# Altium schematic sheet DRAM_LPDDR4X_200P_2X32bit.SchDoc (part 1 of 2)
size 594 x 420 mm; SheetNumber: 16; SheetTotal: 23
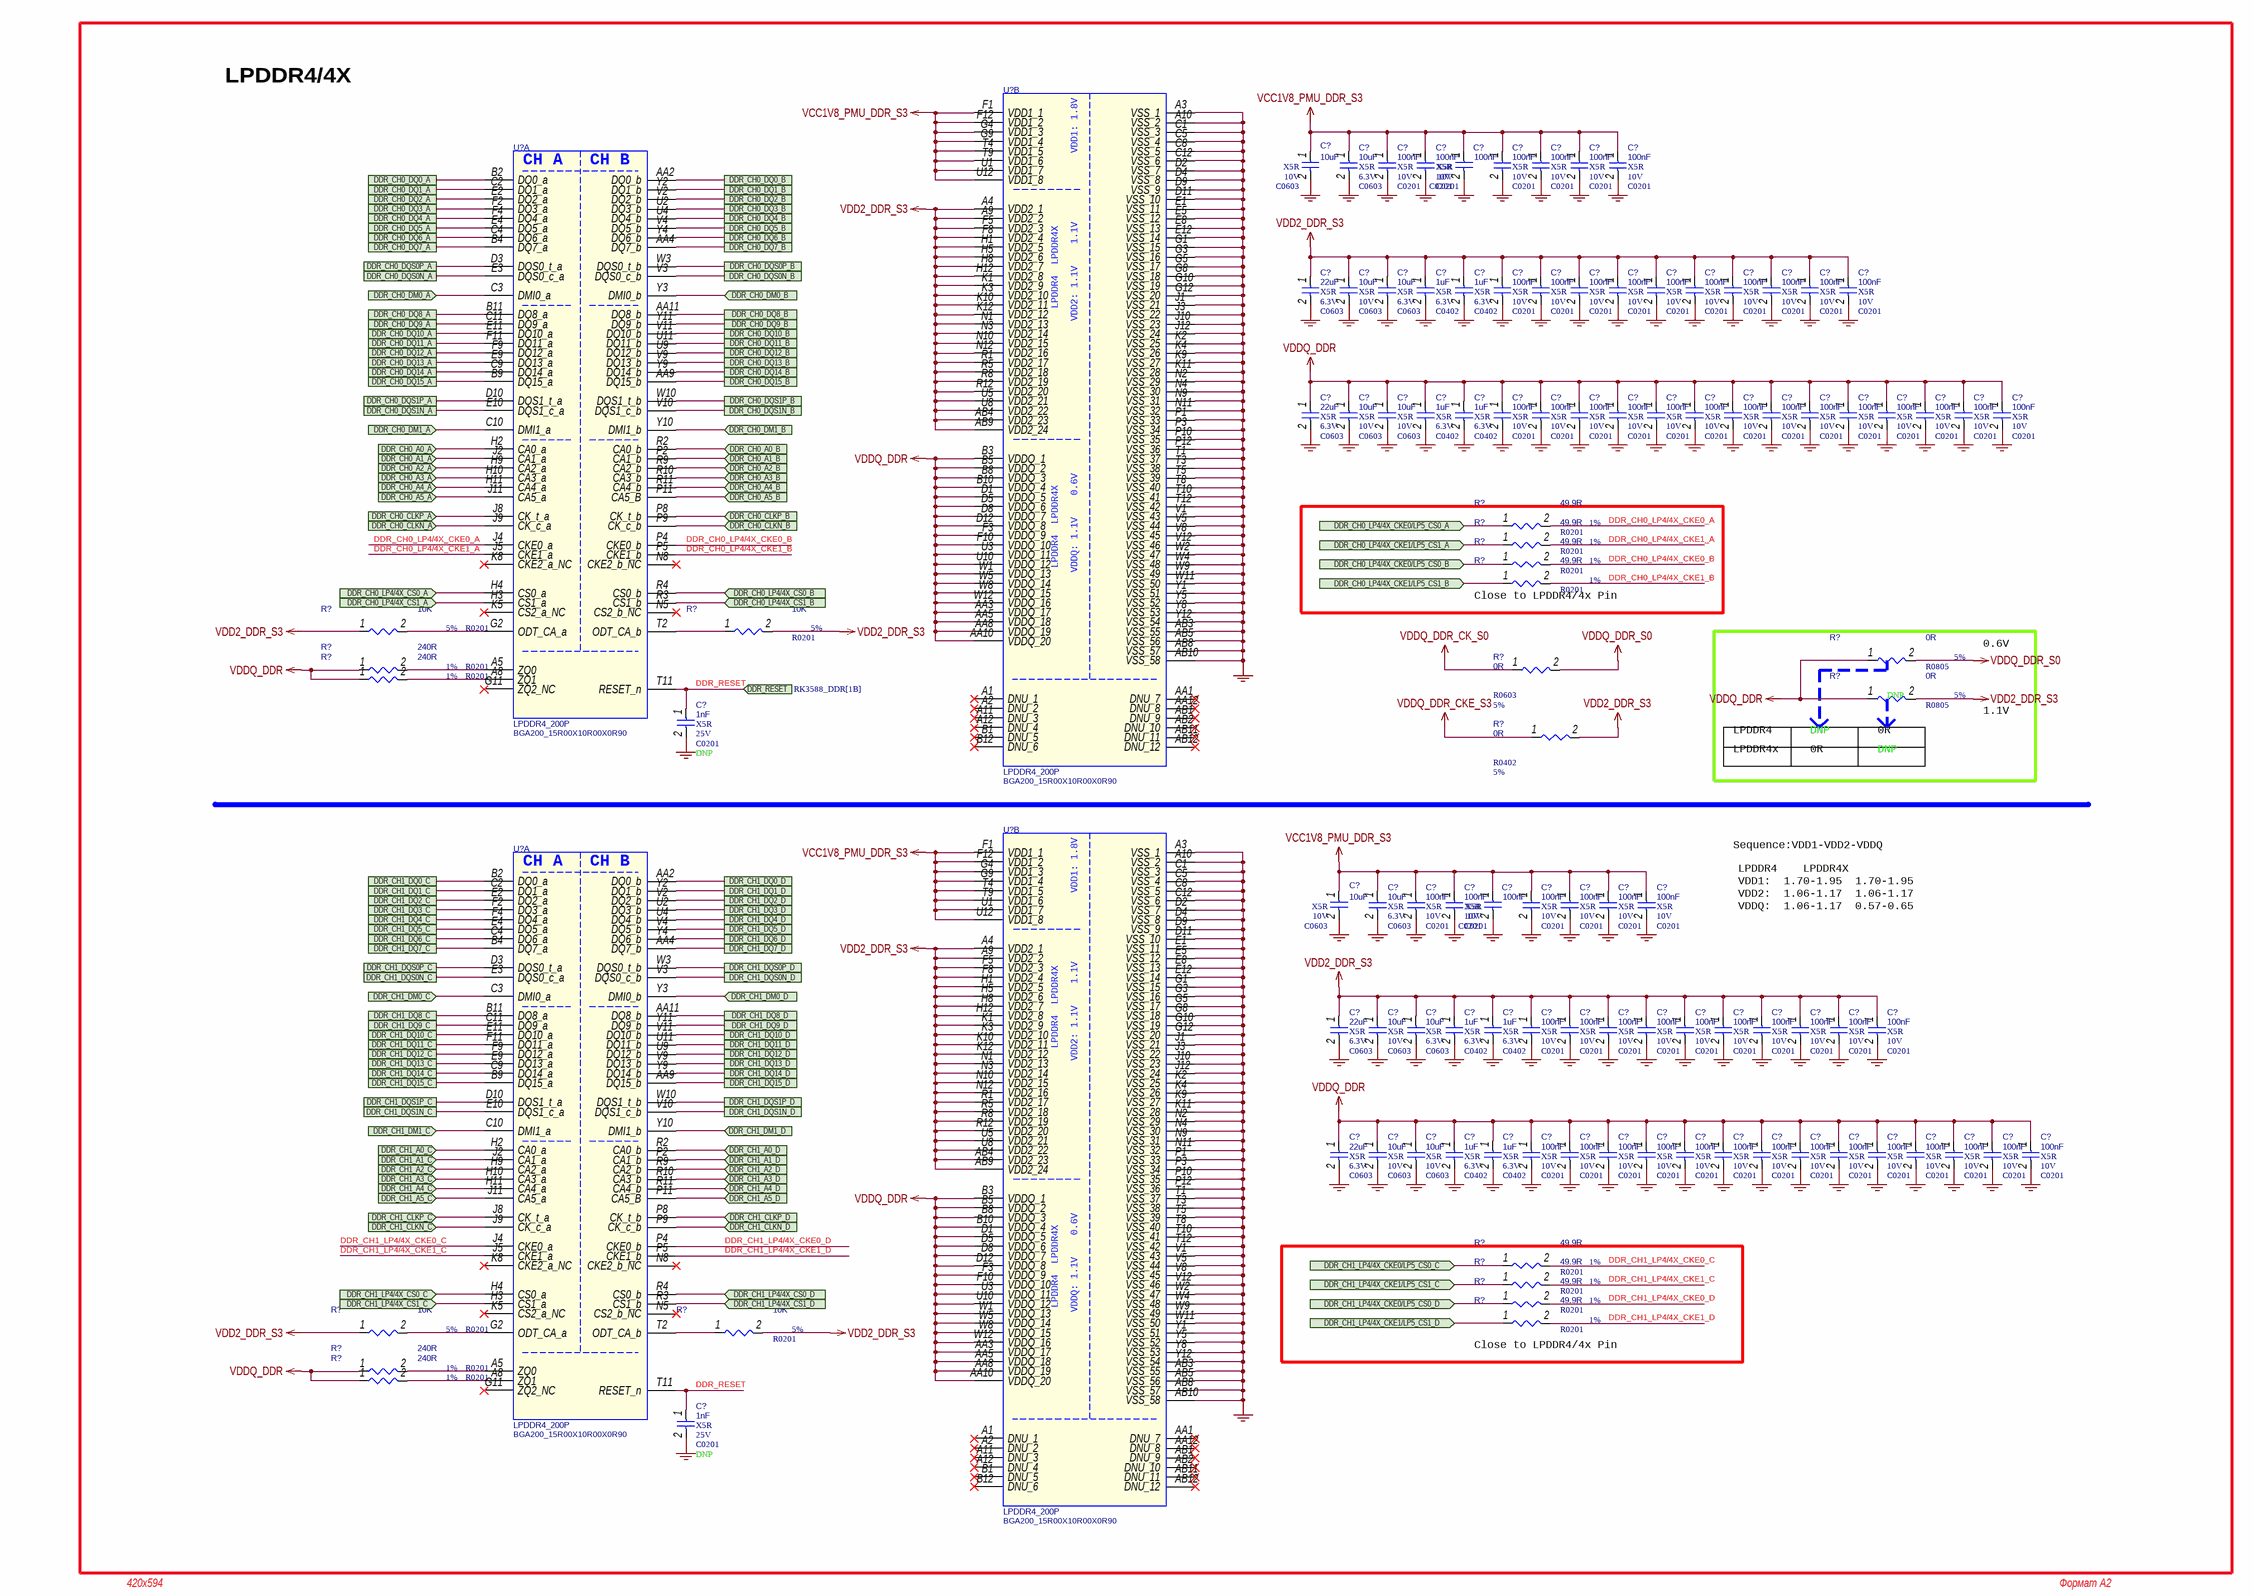
[diagram p0: DRAM_LPDDR4X_200P_2X32bit.SchDoc]

## Parts
(Parts that share a designator on the sheet are numbered #1, #2 ... from top to bottom, then left to right.)
C?#1  10uF  Dielectric: X5R  Voltage: 10V  [C0603]
C?#2  10uF  Dielectric: X5R  Voltage: 6.3V  [C0603]
C?#3  100nF  Dielectric: X5R  Voltage: 10V  [C0201]
C?#4  100nF  Dielectric: X5R  Voltage: 10V  [C0201]
C?#5  100nF  Dielectric: X5R  Voltage: 10V  [C0201]
C?#6  100nF  Dielectric: X5R  Voltage: 10V  [C0201]
C?#7  100nF  Dielectric: X5R  Voltage: 10V  [C0201]
C?#8  100nF  Dielectric: X5R  Voltage: 10V  [C0201]
C?#9  100nF  Dielectric: X5R  Voltage: 10V  [C0201]
C?#10  22uF  Dielectric: X5R  Voltage: 6.3V  [C0603]
C?#11  10uF  Dielectric: X5R  Voltage: 10V  [C0603]
C?#12  10uF  Dielectric: X5R  Voltage: 6.3V  [C0603]
C?#13  1uF  Dielectric: X5R  Voltage: 6.3V  [C0402]
C?#14  1uF  Dielectric: X5R  Voltage: 6.3V  [C0402]
C?#15  100nF  Dielectric: X5R  Voltage: 10V  [C0201]
C?#16  100nF  Dielectric: X5R  Voltage: 10V  [C0201]
C?#17  100nF  Dielectric: X5R  Voltage: 10V  [C0201]
C?#18  100nF  Dielectric: X5R  Voltage: 10V  [C0201]
C?#19  100nF  Dielectric: X5R  Voltage: 10V  [C0201]
C?#20  100nF  Dielectric: X5R  Voltage: 10V  [C0201]
C?#21  100nF  Dielectric: X5R  Voltage: 10V  [C0201]
C?#22  100nF  Dielectric: X5R  Voltage: 10V  [C0201]
C?#23  100nF  Dielectric: X5R  Voltage: 10V  [C0201]
C?#24  100nF  Dielectric: X5R  Voltage: 10V  [C0201]
C?#25  22uF  Dielectric: X5R  Voltage: 6.3V  [C0603]
C?#26  10uF  Dielectric: X5R  Voltage: 10V  [C0603]
C?#27  10uF  Dielectric: X5R  Voltage: 10V  [C0603]
C?#28  1uF  Dielectric: X5R  Voltage: 6.3V  [C0402]
C?#29  1uF  Dielectric: X5R  Voltage: 6.3V  [C0402]
C?#30  100nF  Dielectric: X5R  Voltage: 10V  [C0201]
C?#31  100nF  Dielectric: X5R  Voltage: 10V  [C0201]
C?#32  100nF  Dielectric: X5R  Voltage: 10V  [C0201]
C?#33  100nF  Dielectric: X5R  Voltage: 10V  [C0201]
C?#34  100nF  Dielectric: X5R  Voltage: 10V  [C0201]
C?#35  100nF  Dielectric: X5R  Voltage: 10V  [C0201]
C?#36  100nF  Dielectric: X5R  Voltage: 10V  [C0201]
C?#37  100nF  Dielectric: X5R  Voltage: 10V  [C0201]
C?#38  100nF  Dielectric: X5R  Voltage: 10V  [C0201]
C?#39  100nF  Dielectric: X5R  Voltage: 10V  [C0201]
C?#40  100nF  Dielectric: X5R  Voltage: 10V  [C0201]
C?#41  100nF  Dielectric: X5R  Voltage: 10V  [C0201]
C?#42  100nF  Dielectric: X5R  Voltage: 10V  [C0201]
C?#43  100nF  Dielectric: X5R  Voltage: 10V  [C0201]
C?#44  1nF  Dielectric: X5R  Voltage: 25V  OPTION: DNP  [C0201]
C?#45  10uF  Dielectric: X5R  Voltage: 10V  [C0603]
C?#46  10uF  Dielectric: X5R  Voltage: 6.3V  [C0603]
C?#47  100nF  Dielectric: X5R  Voltage: 10V  [C0201]
C?#48  100nF  Dielectric: X5R  Voltage: 10V  [C0201]
C?#49  100nF  Dielectric: X5R  Voltage: 10V  [C0201]
C?#50  100nF  Dielectric: X5R  Voltage: 10V  [C0201]
C?#51  100nF  Dielectric: X5R  Voltage: 10V  [C0201]
C?#52  100nF  Dielectric: X5R  Voltage: 10V  [C0201]
C?#53  100nF  Dielectric: X5R  Voltage: 10V  [C0201]
C?#54  22uF  Dielectric: X5R  Voltage: 6.3V  [C0603]
C?#55  10uF  Dielectric: X5R  Voltage: 10V  [C0603]
C?#56  10uF  Dielectric: X5R  Voltage: 6.3V  [C0603]
C?#57  1uF  Dielectric: X5R  Voltage: 6.3V  [C0402]
C?#58  1uF  Dielectric: X5R  Voltage: 6.3V  [C0402]
C?#59  100nF  Dielectric: X5R  Voltage: 10V  [C0201]
C?#60  100nF  Dielectric: X5R  Voltage: 10V  [C0201]
C?#61  100nF  Dielectric: X5R  Voltage: 10V  [C0201]
C?#62  100nF  Dielectric: X5R  Voltage: 10V  [C0201]
C?#63  100nF  Dielectric: X5R  Voltage: 10V  [C0201]
C?#64  100nF  Dielectric: X5R  Voltage: 10V  [C0201]
C?#65  100nF  Dielectric: X5R  Voltage: 10V  [C0201]
C?#66  100nF  Dielectric: X5R  Voltage: 10V  [C0201]
C?#67  100nF  Dielectric: X5R  Voltage: 10V  [C0201]
C?#68  100nF  Dielectric: X5R  Voltage: 10V  [C0201]
C?#69  22uF  Dielectric: X5R  Voltage: 6.3V  [C0603]
C?#70  10uF  Dielectric: X5R  Voltage: 10V  [C0603]
C?#71  10uF  Dielectric: X5R  Voltage: 10V  [C0603]
C?#72  1uF  Dielectric: X5R  Voltage: 6.3V  [C0402]
C?#73  1uF  Dielectric: X5R  Voltage: 6.3V  [C0402]
C?#74  100nF  Dielectric: X5R  Voltage: 10V  [C0201]
C?#75  100nF  Dielectric: X5R  Voltage: 10V  [C0201]
C?#76  100nF  Dielectric: X5R  Voltage: 10V  [C0201]
C?#77  100nF  Dielectric: X5R  Voltage: 10V  [C0201]
C?#78  100nF  Dielectric: X5R  Voltage: 10V  [C0201]
C?#79  100nF  Dielectric: X5R  Voltage: 10V  [C0201]
C?#80  100nF  Dielectric: X5R  Voltage: 10V  [C0201]
C?#81  100nF  Dielectric: X5R  Voltage: 10V  [C0201]
C?#82  100nF  Dielectric: X5R  Voltage: 10V  [C0201]
C?#83  100nF  Dielectric: X5R  Voltage: 10V  [C0201]
C?#84  100nF  Dielectric: X5R  Voltage: 10V  [C0201]
C?#85  100nF  Dielectric: X5R  Voltage: 10V  [C0201]
C?#86  100nF  Dielectric: X5R  Voltage: 10V  [C0201]
C?#87  100nF  Dielectric: X5R  Voltage: 10V  [C0201]
C?#88  1nF  Dielectric: X5R  Voltage: 25V  OPTION: DNP  [C0201]
R?#1  49.9R  Tolerance: 1%  PCB Footprint: R0201  [R0402]
R?#2  49.9R  Tolerance: 1%  PCB Footprint: R0201  [R0402]
R?#3  49.9R  Tolerance: 1%  PCB Footprint: R0201  [R0402]
R?#4  49.9R  Tolerance: 1%  PCB Footprint: R0201  [R0402]
R?#5  10K  Tolerance: 5%  PCB Footprint: R0201  [R0402]
R?#6  10K  Tolerance: 5%  PCB Footprint: R0201  [R0402]
R?#7  0R  Tolerance: 5%  PCB Footprint: R0805  [R0402]
R?#8  240R  Tolerance: 1%  PCB Footprint: R0201  [R0402]
R?#9  0R  Tolerance: 5%  PCB Footprint: R0603  [R0402]
R?#10  240R  Tolerance: 1%  PCB Footprint: R0201  [R0402]
R?#11  0R  Tolerance: 5%  PCB Footprint: R0805  OPTION: DNP  [R0402]
R?#12  0R  Tolerance: 5%  [R0402]
R?#13  49.9R  Tolerance: 1%  PCB Footprint: R0201  [R0402]
R?#14  49.9R  Tolerance: 1%  PCB Footprint: R0201  [R0402]
R?#15  49.9R  Tolerance: 1%  PCB Footprint: R0201  [R0402]
R?#16  49.9R  Tolerance: 1%  PCB Footprint: R0201  [R0402]
R?#17  10K  Tolerance: 5%  PCB Footprint: R0201  [R0402]
R?#18  10K  Tolerance: 5%  PCB Footprint: R0201  [R0402]
R?#19  240R  Tolerance: 1%  PCB Footprint: R0201  [R0402]
R?#20  240R  Tolerance: 1%  PCB Footprint: R0201  [R0402]
U?#1  LPDDR4_200P  [BGA200_15R00X10R00X0R90]  (part B of 2)
U?#2  LPDDR4_200P  [BGA200_15R00X10R00X0R90]  (part A of 2)
U?#3  LPDDR4_200P  [BGA200_15R00X10R00X0R90]  (part B of 2)
U?#4  LPDDR4_200P  [BGA200_15R00X10R00X0R90]  (part A of 2)

## Blocks framed on the sheet
Close to LPDDR4/4x Pin: R?#1-R?#4
Close to LPDDR4/4x Pin: R?#13-R?#16

## Ports
DDR_CH0_A0_A (in, see RK3588_DDR[1B]), DDR_CH0_A0_B (in, see RK3588_DDR[2B]), DDR_CH0_A1_A (in, see RK3588_DDR[1B]), DDR_CH0_A1_B (in, see RK3588_DDR[2B]), DDR_CH0_A2_A (in, see RK3588_DDR[1B]), DDR_CH0_A2_B (in, see RK3588_DDR[2B]), DDR_CH0_A3_A (in, see RK3588_DDR[1B]), DDR_CH0_A3_B (in, see RK3588_DDR[2B]), DDR_CH0_A4_A (in, see RK3588_DDR[1B]), DDR_CH0_A4_B (in, see RK3588_DDR[2B]), DDR_CH0_A5_A (in, see RK3588_DDR[1B]), DDR_CH0_A5_B (in, see RK3588_DDR[2B]), DDR_CH0_CLKN_A (in, see RK3588_DDR[1B]), DDR_CH0_CLKN_B (in, see RK3588_DDR[2B]), DDR_CH0_CLKP_A (in, see RK3588_DDR[1B]), DDR_CH0_CLKP_B (in, see RK3588_DDR[2B]), DDR_CH0_DM0_A (in, see RK3588_DDR[1B]), DDR_CH0_DM0_B (in, see RK3588_DDR[2B]), DDR_CH0_DM1_A (in, see RK3588_DDR[1B]), DDR_CH0_DM1_B (in, see RK3588_DDR[2B]), DDR_CH0_DQ0_A (see RK3588_DDR[1A]), DDR_CH0_DQ0_B (see RK3588_DDR[2A]), DDR_CH0_DQ1_A (see RK3588_DDR[1A]), DDR_CH0_DQ1_B (see RK3588_DDR[2A]), DDR_CH0_DQ2_A (see RK3588_DDR[1A]), DDR_CH0_DQ2_B (see RK3588_DDR[2A]), DDR_CH0_DQ3_A (see RK3588_DDR[1A]), DDR_CH0_DQ3_B (see RK3588_DDR[2A]), DDR_CH0_DQ4_A (see RK3588_DDR[1A]), DDR_CH0_DQ4_B (see RK3588_DDR[2A]), DDR_CH0_DQ5_A (see RK3588_DDR[1A]), DDR_CH0_DQ5_B (see RK3588_DDR[2A]), DDR_CH0_DQ6_A (see RK3588_DDR[1A]), DDR_CH0_DQ6_B (see RK3588_DDR[2A]), DDR_CH0_DQ7_A (see RK3588_DDR[1A]), DDR_CH0_DQ7_B (see RK3588_DDR[2A]), DDR_CH0_DQ8_A (see RK3588_DDR[1A]), DDR_CH0_DQ8_B (see RK3588_DDR[2A]), DDR_CH0_DQ9_A (see RK3588_DDR[1A]), DDR_CH0_DQ9_B (see RK3588_DDR[2A]), DDR_CH0_DQ10_A (see RK3588_DDR[1A]), DDR_CH0_DQ10_B (see RK3588_DDR[2A]), DDR_CH0_DQ11_A (see RK3588_DDR[1A]), DDR_CH0_DQ11_B (see RK3588_DDR[2A]), DDR_CH0_DQ12_A (see RK3588_DDR[1B]), DDR_CH0_DQ12_B (see RK3588_DDR[2B]), DDR_CH0_DQ13_A (see RK3588_DDR[1B]), DDR_CH0_DQ13_B (see RK3588_DDR[2B]), DDR_CH0_DQ14_A (see RK3588_DDR[1B]), DDR_CH0_DQ14_B (see RK3588_DDR[2B]), DDR_CH0_DQ15_A (see RK3588_DDR[1B]), DDR_CH0_DQ15_B (see RK3588_DDR[2B]), DDR_CH0_DQS0N_A (see RK3588_DDR[1B]), DDR_CH0_DQS0N_B (see RK3588_DDR[2B]), DDR_CH0_DQS0P_A (see RK3588_DDR[1B]), DDR_CH0_DQS0P_B (see RK3588_DDR[2B]), DDR_CH0_DQS1N_A (see RK3588_DDR[1B]), DDR_CH0_DQS1N_B (see RK3588_DDR[2B]), DDR_CH0_DQS1P_A (see RK3588_DDR[1B]), DDR_CH0_DQS1P_B (see RK3588_DDR[2B]), DDR_CH0_LP4/4X_CKE0/LP5_CS0_A (in, see RK3588_DDR[1B]), DDR_CH0_LP4/4X_CKE0/LP5_CS0_B (in, see RK3588_DDR[2B]), DDR_CH0_LP4/4X_CKE1/LP5_CS1_A (in, see RK3588_DDR[1B]), DDR_CH0_LP4/4X_CKE1/LP5_CS1_B (in, see RK3588_DDR[2B]), DDR_CH0_LP4/4X_CS0_A (in, see RK3588_DDR[1B]), DDR_CH0_LP4/4X_CS0_B (in, see RK3588_DDR[2B]), DDR_CH0_LP4/4X_CS1_A (in, see RK3588_DDR[1B]), DDR_CH0_LP4/4X_CS1_B (in, see RK3588_DDR[2B]), DDR_CH1_A0_C (in, see RK3588_DDR[3B]), DDR_CH1_A0_D (in, see RK3588_DDR[4B]), DDR_CH1_A1_C (in, see RK3588_DDR[3B]), DDR_CH1_A1_D (in, see RK3588_DDR[4B]), DDR_CH1_A2_C (in, see RK3588_DDR[3B]), DDR_CH1_A2_D (in, see RK3588_DDR[4B]), DDR_CH1_A3_C (in, see RK3588_DDR[3B]), DDR_CH1_A3_D (in, see RK3588_DDR[4B]), DDR_CH1_A4_C (in, see RK3588_DDR[3B]), DDR_CH1_A4_D (in, see RK3588_DDR[4B]), DDR_CH1_A5_C (in, see RK3588_DDR[3B]), DDR_CH1_A5_D (in, see RK3588_DDR[4B]), DDR_CH1_CLKN_C (in, see RK3588_DDR[3B]), DDR_CH1_CLKN_D (in, see RK3588_DDR[4B]), DDR_CH1_CLKP_C (in, see RK3588_DDR[3B]), DDR_CH1_CLKP_D (in, see RK3588_DDR[4B]), DDR_CH1_DM0_C (in, see RK3588_DDR[3B]), DDR_CH1_DM0_D (in, see RK3588_DDR[4B]), DDR_CH1_DM1_C (in, see RK3588_DDR[3B]), DDR_CH1_DM1_D (in, see RK3588_DDR[4B]), DDR_CH1_DQ0_C (see RK3588_DDR[3A]), DDR_CH1_DQ0_D (see RK3588_DDR[4A]), DDR_CH1_DQ1_C (see RK3588_DDR[3A]), DDR_CH1_DQ1_D (see RK3588_DDR[4A]), DDR_CH1_DQ2_C (see RK3588_DDR[3A]), DDR_CH1_DQ2_D (see RK3588_DDR[4A]), DDR_CH1_DQ3_C (see RK3588_DDR[3A]), DDR_CH1_DQ3_D (see RK3588_DDR[4A]), DDR_CH1_DQ4_C (see RK3588_DDR[3A]), DDR_CH1_DQ4_D (see RK3588_DDR[4A]), DDR_CH1_DQ5_C (see RK3588_DDR[3A]), DDR_CH1_DQ5_D (see RK3588_DDR[4A]), DDR_CH1_DQ6_C (see RK3588_DDR[3A]), DDR_CH1_DQ6_D (see RK3588_DDR[4A]), DDR_CH1_DQ7_C (see RK3588_DDR[3A]), DDR_CH1_DQ7_D (see RK3588_DDR[4A]), DDR_CH1_DQ8_C (see RK3588_DDR[3A]), DDR_CH1_DQ8_D (see RK3588_DDR[4A]), DDR_CH1_DQ9_C (see RK3588_DDR[3A]), DDR_CH1_DQ9_D (see RK3588_DDR[4A]), DDR_CH1_DQ10_C (see RK3588_DDR[3A]), DDR_CH1_DQ10_D (see RK3588_DDR[4A]), DDR_CH1_DQ11_C (see RK3588_DDR[3A]), DDR_CH1_DQ11_D (see RK3588_DDR[4A]), DDR_CH1_DQ12_C (see RK3588_DDR[3B]), DDR_CH1_DQ12_D (see RK3588_DDR[4B]), DDR_CH1_DQ13_C (see RK3588_DDR[3B]), DDR_CH1_DQ13_D (see RK3588_DDR[4B]), DDR_CH1_DQ14_C (see RK3588_DDR[3B]), DDR_CH1_DQ14_D (see RK3588_DDR[4B]), DDR_CH1_DQ15_C (see RK3588_DDR[3B]), DDR_CH1_DQ15_D (see RK3588_DDR[4B]), DDR_CH1_DQS0N_C (see RK3588_DDR[3B]), DDR_CH1_DQS0N_D (see RK3588_DDR[4B]), DDR_CH1_DQS0P_C (see RK3588_DDR[3B]), DDR_CH1_DQS0P_D (see RK3588_DDR[4B]), DDR_CH1_DQS1N_C (see RK3588_DDR[3B]), DDR_CH1_DQS1N_D (see RK3588_DDR[4B]), DDR_CH1_DQS1P_C (see RK3588_DDR[3B]), DDR_CH1_DQS1P_D (see RK3588_DDR[4B]), DDR_CH1_LP4/4X_CKE0/LP5_CS0_C (in, see RK3588_DDR[3B]), DDR_CH1_LP4/4X_CKE0/LP5_CS0_D (in, see RK3588_DDR[4B]), DDR_CH1_LP4/4X_CKE1/LP5_CS1_C (in, see RK3588_DDR[3B]), DDR_CH1_LP4/4X_CKE1/LP5_CS1_D (in, see RK3588_DDR[4B]), DDR_CH1_LP4/4X_CS0_C (in, see RK3588_DDR[3B]), DDR_CH1_LP4/4X_CS0_D (in, see RK3588_DDR[4B]), DDR_CH1_LP4/4X_CS1_C (in, see RK3588_DDR[3B]), DDR_CH1_LP4/4X_CS1_D (in, see RK3588_DDR[4B]), DDR_RESET (in, see RK3588_DDR[1B])

## Nets
GND: C?#1.2 C?#2.2 C?#3.2 C?#4.2 C?#5.2 C?#6.2 C?#7.2 C?#8.2 C?#9.2 C?#10.2 C?#11.2 C?#12.2 C?#13.2 C?#14.2 C?#15.2 C?#16.2 C?#17.2 C?#18.2 C?#19.2 C?#20.2 C?#21.2 C?#22.2 C?#23.2 C?#24.2 C?#25.2 C?#26.2 C?#27.2 C?#28.2 C?#29.2 C?#30.2 C?#31.2 C?#32.2 C?#33.2 C?#34.2 C?#35.2 C?#36.2 C?#37.2 C?#38.2 C?#39.2 C?#40.2 C?#41.2 C?#42.2 C?#43.2 C?#44.2 C?#45.2 C?#46.2 C?#47.2 C?#48.2 C?#49.2 C?#50.2 C?#51.2 C?#52.2 C?#53.2 C?#54.2 C?#55.2 C?#56.2 C?#57.2 C?#58.2 C?#59.2 C?#60.2 C?#61.2 C?#62.2 C?#63.2 C?#64.2 C?#65.2 C?#66.2 C?#67.2 C?#68.2 C?#69.2 C?#70.2 C?#71.2 C?#72.2 C?#73.2 C?#74.2 C?#75.2 C?#76.2 C?#77.2 C?#78.2 C?#79.2 C?#80.2 C?#81.2 C?#82.2 C?#83.2 C?#84.2 C?#85.2 C?#86.2 C?#87.2 C?#88.2 U?#1.A3(VSS_1) U?#1.A10(VSS_2) U?#1.AB3(VSS_55) U?#1.AB5(VSS_56) U?#1.AB8(VSS_57) U?#1.AB10(VSS_58) U?#1.C1(VSS_3) U?#1.C5(VSS_4) U?#1.C8(VSS_5) U?#1.C12(VSS_6) U?#1.D2(VSS_7) U?#1.D4(VSS_8) U?#1.D9(VSS_9) U?#1.D11(VSS_10) U?#1.E1(VSS_11) U?#1.E5(VSS_12) U?#1.E8(VSS_13) U?#1.E12(VSS_14) U?#1.G1(VSS_15) U?#1.G3(VSS_16) U?#1.G5(VSS_17) U?#1.G8(VSS_18) U?#1.G10(VSS_19) U?#1.G12(VSS_20) U?#1.J1(VSS_21) U?#1.J3(VSS_22) U?#1.J10(VSS_23) U?#1.J12(VSS_24) U?#1.K2(VSS_25) U?#1.K4(VSS_26) U?#1.K9(VSS_27) U?#1.K11(VSS_28) U?#1.N2(VSS_29) U?#1.N4(VSS_30) U?#1.N9(VSS_31) U?#1.N11(VSS_32) U?#1.P1(VSS_33) U?#1.P3(VSS_34) U?#1.P10(VSS_35) U?#1.P12(VSS_36) U?#1.T1(VSS_37) U?#1.T3(VSS_38) U?#1.T5(VSS_39) U?#1.T8(VSS_40) U?#1.T10(VSS_41) U?#1.T12(VSS_42) U?#1.V1(VSS_43) U?#1.V5(VSS_44) U?#1.V8(VSS_45) U?#1.V12(VSS_46) U?#1.W2(VSS_47) U?#1.W4(VSS_48) U?#1.W9(VSS_49) U?#1.W11(VSS_50) U?#1.Y1(VSS_51) U?#1.Y5(VSS_52) U?#1.Y8(VSS_53) U?#1.Y12(VSS_54) U?#3.A3(VSS_1) U?#3.A10(VSS_2) U?#3.AB3(VSS_55) U?#3.AB5(VSS_56) U?#3.AB8(VSS_57) U?#3.AB10(VSS_58) U?#3.C1(VSS_3) U?#3.C5(VSS_4) U?#3.C8(VSS_5) U?#3.C12(VSS_6) U?#3.D2(VSS_7) U?#3.D4(VSS_8) U?#3.D9(VSS_9) U?#3.D11(VSS_10) U?#3.E1(VSS_11) U?#3.E5(VSS_12) U?#3.E8(VSS_13) U?#3.E12(VSS_14) U?#3.G1(VSS_15) U?#3.G3(VSS_16) U?#3.G5(VSS_17) U?#3.G8(VSS_18) U?#3.G10(VSS_19) U?#3.G12(VSS_20) U?#3.J1(VSS_21) U?#3.J3(VSS_22) U?#3.J10(VSS_23) U?#3.J12(VSS_24) U?#3.K2(VSS_25) U?#3.K4(VSS_26) U?#3.K9(VSS_27) U?#3.K11(VSS_28) U?#3.N2(VSS_29) U?#3.N4(VSS_30) U?#3.N9(VSS_31) U?#3.N11(VSS_32) U?#3.P1(VSS_33) U?#3.P3(VSS_34) U?#3.P10(VSS_35) U?#3.P12(VSS_36) U?#3.T1(VSS_37) U?#3.T3(VSS_38) U?#3.T5(VSS_39) U?#3.T8(VSS_40) U?#3.T10(VSS_41) U?#3.T12(VSS_42) U?#3.V1(VSS_43) U?#3.V5(VSS_44) U?#3.V8(VSS_45) U?#3.V12(VSS_46) U?#3.W2(VSS_47) U?#3.W4(VSS_48) U?#3.W9(VSS_49) U?#3.W11(VSS_50) U?#3.Y1(VSS_51) U?#3.Y5(VSS_52) U?#3.Y8(VSS_53) U?#3.Y12(VSS_54)
VCC1V8_PMU_DDR_S3: C?#1.1 C?#2.1 C?#3.1 C?#4.1 C?#5.1 C?#6.1 C?#7.1 C?#8.1 C?#9.1 C?#45.1 C?#46.1 C?#47.1 C?#48.1 C?#49.1 C?#50.1 C?#51.1 C?#52.1 C?#53.1 U?#1.F1(VDD1_1) U?#1.F12(VDD1_2) U?#1.G4(VDD1_3) U?#1.G9(VDD1_4) U?#1.T4(VDD1_5) U?#1.T9(VDD1_6) U?#1.U1(VDD1_7) U?#1.U12(VDD1_8) U?#3.F1(VDD1_1) U?#3.F12(VDD1_2) U?#3.G4(VDD1_3) U?#3.G9(VDD1_4) U?#3.T4(VDD1_5) U?#3.T9(VDD1_6) U?#3.U1(VDD1_7) U?#3.U12(VDD1_8)
VDD2_DDR_S3: C?#10.1 C?#11.1 C?#12.1 C?#13.1 C?#14.1 C?#15.1 C?#16.1 C?#17.1 C?#18.1 C?#19.1 C?#20.1 C?#21.1 C?#22.1 C?#23.1 C?#24.1 C?#54.1 C?#55.1 C?#56.1 C?#57.1 C?#58.1 C?#59.1 C?#60.1 C?#61.1 C?#62.1 C?#63.1 C?#64.1 C?#65.1 C?#66.1 C?#67.1 C?#68.1 R?#5.1 R?#6.2 R?#11.2 R?#12.2 R?#17.1 R?#18.2 U?#1.A4(VDD2_1) U?#1.A9(VDD2_2) U?#1.AB4(VDD2_23) U?#1.AB9(VDD2_24) U?#1.F5(VDD2_3) U?#1.F8(VDD2_4) U?#1.H1(VDD2_5) U?#1.H5(VDD2_6) U?#1.H8(VDD2_7) U?#1.H12(VDD2_8) U?#1.K1(VDD2_9) U?#1.K3(VDD2_10) U?#1.K10(VDD2_11) U?#1.K12(VDD2_12) U?#1.N1(VDD2_13) U?#1.N3(VDD2_14) U?#1.N10(VDD2_15) U?#1.N12(VDD2_16) U?#1.R1(VDD2_17) U?#1.R5(VDD2_18) U?#1.R8(VDD2_19) U?#1.R12(VDD2_20) U?#1.U5(VDD2_21) U?#1.U8(VDD2_22) U?#3.A4(VDD2_1) U?#3.A9(VDD2_2) U?#3.AB4(VDD2_23) U?#3.AB9(VDD2_24) U?#3.F5(VDD2_3) U?#3.F8(VDD2_4) U?#3.H1(VDD2_5) U?#3.H5(VDD2_6) U?#3.H8(VDD2_7) U?#3.H12(VDD2_8) U?#3.K1(VDD2_9) U?#3.K3(VDD2_10) U?#3.K10(VDD2_11) U?#3.K12(VDD2_12) U?#3.N1(VDD2_13) U?#3.N3(VDD2_14) U?#3.N10(VDD2_15) U?#3.N12(VDD2_16) U?#3.R1(VDD2_17) U?#3.R5(VDD2_18) U?#3.R8(VDD2_19) U?#3.R12(VDD2_20) U?#3.U5(VDD2_21) U?#3.U8(VDD2_22)
VDDQ_DDR: C?#25.1 C?#26.1 C?#27.1 C?#28.1 C?#29.1 C?#30.1 C?#31.1 C?#32.1 C?#33.1 C?#34.1 C?#35.1 C?#36.1 C?#37.1 C?#38.1 C?#39.1 C?#40.1 C?#41.1 C?#42.1 C?#43.1 C?#69.1 C?#70.1 C?#71.1 C?#72.1 C?#73.1 C?#74.1 C?#75.1 C?#76.1 C?#77.1 C?#78.1 C?#79.1 C?#80.1 C?#81.1 C?#82.1 C?#83.1 C?#84.1 C?#85.1 C?#86.1 C?#87.1 R?#7.1 R?#8.1 R?#10.1 R?#11.1 R?#19.1 R?#20.1 U?#1.AA3(VDDQ_17) U?#1.AA5(VDDQ_18) U?#1.AA8(VDDQ_19) U?#1.AA10(VDDQ_20) U?#1.B3(VDDQ_1) U?#1.B5(VDDQ_2) U?#1.B8(VDDQ_3) U?#1.B10(VDDQ_4) U?#1.D1(VDDQ_5) U?#1.D5(VDDQ_6) U?#1.D8(VDDQ_7) U?#1.D12(VDDQ_8) U?#1.F3(VDDQ_9) U?#1.F10(VDDQ_10) U?#1.U3(VDDQ_11) U?#1.U10(VDDQ_12) U?#1.W1(VDDQ_13) U?#1.W5(VDDQ_14) U?#1.W8(VDDQ_15) U?#1.W12(VDDQ_16) U?#3.AA3(VDDQ_17) U?#3.AA5(VDDQ_18) U?#3.AA8(VDDQ_19) U?#3.AA10(VDDQ_20) U?#3.B3(VDDQ_1) U?#3.B5(VDDQ_2) U?#3.B8(VDDQ_3) U?#3.B10(VDDQ_4) U?#3.D1(VDDQ_5) U?#3.D5(VDDQ_6) U?#3.D8(VDDQ_7) U?#3.D12(VDDQ_8) U?#3.F3(VDDQ_9) U?#3.F10(VDDQ_10) U?#3.U3(VDDQ_11) U?#3.U10(VDDQ_12) U?#3.W1(VDDQ_13) U?#3.W5(VDDQ_14) U?#3.W8(VDDQ_15) U?#3.W12(VDDQ_16)
VDDQ_DDR_CK_S0: R?#9.1
VDDQ_DDR_CKE_S3: R?#12.1
VDDQ_DDR_S0: R?#7.2 R?#9.2
DDR_CH0_A0_A: U?#2.H2(CA0_a) ; port DDR_CH0_A0_A
DDR_CH0_A0_B: U?#2.R2(CA0_b) ; port DDR_CH0_A0_B
DDR_CH0_A1_A: U?#2.J2(CA1_a) ; port DDR_CH0_A1_A
DDR_CH0_A1_B: U?#2.P2(CA1_b) ; port DDR_CH0_A1_B
DDR_CH0_A2_A: U?#2.H9(CA2_a) ; port DDR_CH0_A2_A
DDR_CH0_A2_B: U?#2.R9(CA2_b) ; port DDR_CH0_A2_B
DDR_CH0_A3_A: U?#2.H10(CA3_a) ; port DDR_CH0_A3_A
DDR_CH0_A3_B: U?#2.R10(CA3_b) ; port DDR_CH0_A3_B
DDR_CH0_A4_A: U?#2.H11(CA4_a) ; port DDR_CH0_A4_A
DDR_CH0_A4_B: U?#2.R11(CA4_b) ; port DDR_CH0_A4_B
DDR_CH0_A5_A: U?#2.J11(CA5_a) ; port DDR_CH0_A5_A
DDR_CH0_A5_B: U?#2.P11(CA5_B) ; port DDR_CH0_A5_B
DDR_CH0_CLKN_A: U?#2.J9(CK_c_a) ; port DDR_CH0_CLKN_A
DDR_CH0_CLKN_B: U?#2.P9(CK_c_b) ; port DDR_CH0_CLKN_B
DDR_CH0_CLKP_A: U?#2.J8(CK_t_a) ; port DDR_CH0_CLKP_A
DDR_CH0_CLKP_B: U?#2.P8(CK_t_b) ; port DDR_CH0_CLKP_B
DDR_CH0_DM0_A: U?#2.C3(DMI0_a) ; port DDR_CH0_DM0_A
DDR_CH0_DM0_B: U?#2.Y3(DMI0_b) ; port DDR_CH0_DM0_B
DDR_CH0_DM1_A: U?#2.C10(DMI1_a) ; port DDR_CH0_DM1_A
DDR_CH0_DM1_B: U?#2.Y10(DMI1_b) ; port DDR_CH0_DM1_B
DDR_CH0_DQ0_A: U?#2.B2(DQ0_a) ; port DDR_CH0_DQ0_A
DDR_CH0_DQ0_B: U?#2.AA2(DQ0_b) ; port DDR_CH0_DQ0_B
DDR_CH0_DQ1_A: U?#2.C2(DQ1_a) ; port DDR_CH0_DQ1_A
DDR_CH0_DQ1_B: U?#2.Y2(DQ1_b) ; port DDR_CH0_DQ1_B
DDR_CH0_DQ2_A: U?#2.E2(DQ2_a) ; port DDR_CH0_DQ2_A
DDR_CH0_DQ2_B: U?#2.V2(DQ2_b) ; port DDR_CH0_DQ2_B
DDR_CH0_DQ3_A: U?#2.F2(DQ3_a) ; port DDR_CH0_DQ3_A
DDR_CH0_DQ3_B: U?#2.U2(DQ3_b) ; port DDR_CH0_DQ3_B
DDR_CH0_DQ4_A: U?#2.F4(DQ4_a) ; port DDR_CH0_DQ4_A
DDR_CH0_DQ4_B: U?#2.U4(DQ4_b) ; port DDR_CH0_DQ4_B
DDR_CH0_DQ5_A: U?#2.E4(DQ5_a) ; port DDR_CH0_DQ5_A
DDR_CH0_DQ5_B: U?#2.V4(DQ5_b) ; port DDR_CH0_DQ5_B
DDR_CH0_DQ6_A: U?#2.C4(DQ6_a) ; port DDR_CH0_DQ6_A
DDR_CH0_DQ6_B: U?#2.Y4(DQ6_b) ; port DDR_CH0_DQ6_B
DDR_CH0_DQ7_A: U?#2.B4(DQ7_a) ; port DDR_CH0_DQ7_A
DDR_CH0_DQ7_B: U?#2.AA4(DQ7_b) ; port DDR_CH0_DQ7_B
DDR_CH0_DQ8_A: U?#2.B11(DQ8_a) ; port DDR_CH0_DQ8_A
DDR_CH0_DQ8_B: U?#2.AA11(DQ8_b) ; port DDR_CH0_DQ8_B
DDR_CH0_DQ9_A: U?#2.C11(DQ9_a) ; port DDR_CH0_DQ9_A
DDR_CH0_DQ9_B: U?#2.Y11(DQ9_b) ; port DDR_CH0_DQ9_B
DDR_CH0_DQ10_A: U?#2.E11(DQ10_a) ; port DDR_CH0_DQ10_A
DDR_CH0_DQ10_B: U?#2.V11(DQ10_b) ; port DDR_CH0_DQ10_B
DDR_CH0_DQ11_A: U?#2.F11(DQ11_a) ; port DDR_CH0_DQ11_A
DDR_CH0_DQ11_B: U?#2.U11(DQ11_b) ; port DDR_CH0_DQ11_B
DDR_CH0_DQ12_A: U?#2.F9(DQ12_a) ; port DDR_CH0_DQ12_A
DDR_CH0_DQ12_B: U?#2.U9(DQ12_b) ; port DDR_CH0_DQ12_B
DDR_CH0_DQ13_A: U?#2.E9(DQ13_a) ; port DDR_CH0_DQ13_A
DDR_CH0_DQ13_B: U?#2.V9(DQ13_b) ; port DDR_CH0_DQ13_B
DDR_CH0_DQ14_A: U?#2.C9(DQ14_a) ; port DDR_CH0_DQ14_A
DDR_CH0_DQ14_B: U?#2.Y9(DQ14_b) ; port DDR_CH0_DQ14_B
DDR_CH0_DQ15_A: U?#2.B9(DQ15_a) ; port DDR_CH0_DQ15_A
DDR_CH0_DQ15_B: U?#2.AA9(DQ15_b) ; port DDR_CH0_DQ15_B
DDR_CH0_DQS0N_A: U?#2.E3(DQS0_c_a) ; port DDR_CH0_DQS0N_A
DDR_CH0_DQS0N_B: U?#2.V3(DQS0_c_b) ; port DDR_CH0_DQS0N_B
DDR_CH0_DQS0P_A: U?#2.D3(DQS0_t_a) ; port DDR_CH0_DQS0P_A
DDR_CH0_DQS0P_B: U?#2.W3(DQS0_t_b) ; port DDR_CH0_DQS0P_B
DDR_CH0_DQS1N_A: U?#2.E10(DQS1_c_a) ; port DDR_CH0_DQS1N_A
DDR_CH0_DQS1N_B: U?#2.V10(DQS1_c_b) ; port DDR_CH0_DQS1N_B
DDR_CH0_DQS1P_A: U?#2.D10(DQS1_t_a) ; port DDR_CH0_DQS1P_A
DDR_CH0_DQS1P_B: U?#2.W10(DQS1_t_b) ; port DDR_CH0_DQS1P_B
DDR_CH0_LP4/4X_CKE0/LP5_CS0_A: R?#1.1 ; port DDR_CH0_LP4/4X_CKE0/LP5_CS0_A
DDR_CH0_LP4/4X_CKE0/LP5_CS0_B: R?#3.1 ; port DDR_CH0_LP4/4X_CKE0/LP5_CS0_B
DDR_CH0_LP4/4X_CKE0_A: R?#1.2 U?#2.J4(CKE0_a)
DDR_CH0_LP4/4X_CKE0_B: R?#3.2 U?#2.P4(CKE0_b)
DDR_CH0_LP4/4X_CKE1/LP5_CS1_A: R?#2.1 ; port DDR_CH0_LP4/4X_CKE1/LP5_CS1_A
DDR_CH0_LP4/4X_CKE1/LP5_CS1_B: R?#4.1 ; port DDR_CH0_LP4/4X_CKE1/LP5_CS1_B
DDR_CH0_LP4/4X_CKE1_A: R?#2.2 U?#2.J5(CKE1_a)
DDR_CH0_LP4/4X_CKE1_B: R?#4.2 U?#2.P5(CKE1_b)
DDR_CH0_LP4/4X_CS0_A: U?#2.H4(CS0_a) ; port DDR_CH0_LP4/4X_CS0_A
DDR_CH0_LP4/4X_CS0_B: U?#2.R4(CS0_b) ; port DDR_CH0_LP4/4X_CS0_B
DDR_CH0_LP4/4X_CS1_A: U?#2.H3(CS1_a) ; port DDR_CH0_LP4/4X_CS1_A
DDR_CH0_LP4/4X_CS1_B: U?#2.R3(CS1_b) ; port DDR_CH0_LP4/4X_CS1_B
DDR_CH1_A0_C: U?#4.H2(CA0_a) ; port DDR_CH1_A0_C
DDR_CH1_A0_D: U?#4.R2(CA0_b) ; port DDR_CH1_A0_D
DDR_CH1_A1_C: U?#4.J2(CA1_a) ; port DDR_CH1_A1_C
DDR_CH1_A1_D: U?#4.P2(CA1_b) ; port DDR_CH1_A1_D
DDR_CH1_A2_C: U?#4.H9(CA2_a) ; port DDR_CH1_A2_C
DDR_CH1_A2_D: U?#4.R9(CA2_b) ; port DDR_CH1_A2_D
DDR_CH1_A3_C: U?#4.H10(CA3_a) ; port DDR_CH1_A3_C
DDR_CH1_A3_D: U?#4.R10(CA3_b) ; port DDR_CH1_A3_D
DDR_CH1_A4_C: U?#4.H11(CA4_a) ; port DDR_CH1_A4_C
DDR_CH1_A4_D: U?#4.R11(CA4_b) ; port DDR_CH1_A4_D
DDR_CH1_A5_C: U?#4.J11(CA5_a) ; port DDR_CH1_A5_C
DDR_CH1_A5_D: U?#4.P11(CA5_B) ; port DDR_CH1_A5_D
DDR_CH1_CLKN_C: U?#4.J9(CK_c_a) ; port DDR_CH1_CLKN_C
DDR_CH1_CLKN_D: U?#4.P9(CK_c_b) ; port DDR_CH1_CLKN_D
DDR_CH1_CLKP_C: U?#4.J8(CK_t_a) ; port DDR_CH1_CLKP_C
DDR_CH1_CLKP_D: U?#4.P8(CK_t_b) ; port DDR_CH1_CLKP_D
DDR_CH1_DM0_C: U?#4.C3(DMI0_a) ; port DDR_CH1_DM0_C
DDR_CH1_DM0_D: U?#4.Y3(DMI0_b) ; port DDR_CH1_DM0_D
DDR_CH1_DM1_C: U?#4.C10(DMI1_a) ; port DDR_CH1_DM1_C
DDR_CH1_DM1_D: U?#4.Y10(DMI1_b) ; port DDR_CH1_DM1_D
DDR_CH1_DQ0_C: U?#4.B2(DQ0_a) ; port DDR_CH1_DQ0_C
DDR_CH1_DQ0_D: U?#4.AA2(DQ0_b) ; port DDR_CH1_DQ0_D
DDR_CH1_DQ1_C: U?#4.C2(DQ1_a) ; port DDR_CH1_DQ1_C
DDR_CH1_DQ1_D: U?#4.Y2(DQ1_b) ; port DDR_CH1_DQ1_D
DDR_CH1_DQ2_C: U?#4.E2(DQ2_a) ; port DDR_CH1_DQ2_C
DDR_CH1_DQ2_D: U?#4.V2(DQ2_b) ; port DDR_CH1_DQ2_D
DDR_CH1_DQ3_C: U?#4.F2(DQ3_a) ; port DDR_CH1_DQ3_C
DDR_CH1_DQ3_D: U?#4.U2(DQ3_b) ; port DDR_CH1_DQ3_D
DDR_CH1_DQ4_C: U?#4.F4(DQ4_a) ; port DDR_CH1_DQ4_C
DDR_CH1_DQ4_D: U?#4.U4(DQ4_b) ; port DDR_CH1_DQ4_D
DDR_CH1_DQ5_C: U?#4.E4(DQ5_a) ; port DDR_CH1_DQ5_C
DDR_CH1_DQ5_D: U?#4.V4(DQ5_b) ; port DDR_CH1_DQ5_D
DDR_CH1_DQ6_C: U?#4.C4(DQ6_a) ; port DDR_CH1_DQ6_C
DDR_CH1_DQ6_D: U?#4.Y4(DQ6_b) ; port DDR_CH1_DQ6_D
DDR_CH1_DQ7_C: U?#4.B4(DQ7_a) ; port DDR_CH1_DQ7_C
DDR_CH1_DQ7_D: U?#4.AA4(DQ7_b) ; port DDR_CH1_DQ7_D
DDR_CH1_DQ8_C: U?#4.B11(DQ8_a) ; port DDR_CH1_DQ8_C
DDR_CH1_DQ8_D: U?#4.AA11(DQ8_b) ; port DDR_CH1_DQ8_D
DDR_CH1_DQ9_C: U?#4.C11(DQ9_a) ; port DDR_CH1_DQ9_C
DDR_CH1_DQ9_D: U?#4.Y11(DQ9_b) ; port DDR_CH1_DQ9_D
DDR_CH1_DQ10_C: U?#4.E11(DQ10_a) ; port DDR_CH1_DQ10_C
DDR_CH1_DQ10_D: U?#4.V11(DQ10_b) ; port DDR_CH1_DQ10_D
DDR_CH1_DQ11_C: U?#4.F11(DQ11_a) ; port DDR_CH1_DQ11_C
DDR_CH1_DQ11_D: U?#4.U11(DQ11_b) ; port DDR_CH1_DQ11_D
DDR_CH1_DQ12_C: U?#4.F9(DQ12_a) ; port DDR_CH1_DQ12_C
DDR_CH1_DQ12_D: U?#4.U9(DQ12_b) ; port DDR_CH1_DQ12_D
DDR_CH1_DQ13_C: U?#4.E9(DQ13_a) ; port DDR_CH1_DQ13_C
DDR_CH1_DQ13_D: U?#4.V9(DQ13_b) ; port DDR_CH1_DQ13_D
DDR_CH1_DQ14_C: U?#4.C9(DQ14_a) ; port DDR_CH1_DQ14_C
DDR_CH1_DQ14_D: U?#4.Y9(DQ14_b) ; port DDR_CH1_DQ14_D
DDR_CH1_DQ15_C: U?#4.B9(DQ15_a) ; port DDR_CH1_DQ15_C
DDR_CH1_DQ15_D: U?#4.AA9(DQ15_b) ; port DDR_CH1_DQ15_D
DDR_CH1_DQS0N_C: U?#4.E3(DQS0_c_a) ; port DDR_CH1_DQS0N_C
DDR_CH1_DQS0N_D: U?#4.V3(DQS0_c_b) ; port DDR_CH1_DQS0N_D
DDR_CH1_DQS0P_C: U?#4.D3(DQS0_t_a) ; port DDR_CH1_DQS0P_C
DDR_CH1_DQS0P_D: U?#4.W3(DQS0_t_b) ; port DDR_CH1_DQS0P_D
DDR_CH1_DQS1N_C: U?#4.E10(DQS1_c_a) ; port DDR_CH1_DQS1N_C
DDR_CH1_DQS1N_D: U?#4.V10(DQS1_c_b) ; port DDR_CH1_DQS1N_D
DDR_CH1_DQS1P_C: U?#4.D10(DQS1_t_a) ; port DDR_CH1_DQS1P_C
DDR_CH1_DQS1P_D: U?#4.W10(DQS1_t_b) ; port DDR_CH1_DQS1P_D
DDR_CH1_LP4/4X_CKE0/LP5_CS0_C: R?#13.1 ; port DDR_CH1_LP4/4X_CKE0/LP5_CS0_C
DDR_CH1_LP4/4X_CKE0/LP5_CS0_D: R?#15.1 ; port DDR_CH1_LP4/4X_CKE0/LP5_CS0_D
DDR_CH1_LP4/4X_CKE0_C: R?#13.2 U?#4.J4(CKE0_a)
DDR_CH1_LP4/4X_CKE0_D: R?#15.2 U?#4.P4(CKE0_b)
DDR_CH1_LP4/4X_CKE1/LP5_CS1_C: R?#14.1 ; port DDR_CH1_LP4/4X_CKE1/LP5_CS1_C
DDR_CH1_LP4/4X_CKE1/LP5_CS1_D: R?#16.1 ; port DDR_CH1_LP4/4X_CKE1/LP5_CS1_D
DDR_CH1_LP4/4X_CKE1_C: R?#14.2 U?#4.J5(CKE1_a)
DDR_CH1_LP4/4X_CKE1_D: R?#16.2 U?#4.P5(CKE1_b)
DDR_CH1_LP4/4X_CS0_C: U?#4.H4(CS0_a) ; port DDR_CH1_LP4/4X_CS0_C
DDR_CH1_LP4/4X_CS0_D: U?#4.R4(CS0_b) ; port DDR_CH1_LP4/4X_CS0_D
DDR_CH1_LP4/4X_CS1_C: U?#4.H3(CS1_a) ; port DDR_CH1_LP4/4X_CS1_C
DDR_CH1_LP4/4X_CS1_D: U?#4.R3(CS1_b) ; port DDR_CH1_LP4/4X_CS1_D
DDR_RESET: C?#44.1 C?#88.1 U?#2.T11(RESET_n) U?#4.T11(RESET_n) ; port DDR_RESET
NetR?#5_2: R?#5.2 U?#2.G2(ODT_CA_a)
NetR?#6_1: R?#6.1 U?#2.T2(ODT_CA_b)
NetR?#8_2: R?#8.2 U?#2.A5(ZQ0)
NetR?#10_2: R?#10.2 U?#2.A8(ZQ1)
NetR?#17_2: R?#17.2 U?#4.G2(ODT_CA_a)
NetR?#18_1: R?#18.1 U?#4.T2(ODT_CA_b)
NetR?#19_2: R?#19.2 U?#4.A5(ZQ0)
NetR?#20_2: R?#20.2 U?#4.A8(ZQ1)

Not connected (* = marked no-connect by the designer): U?#1 A1(DNU_1)* A2(DNU_2)* A11(DNU_3)* A12(DNU_4)* AA1(DNU_7)* AA12(DNU_8)* AB1(DNU_9)* AB2(DNU_10)* AB11(DNU_11)* AB12(DNU_12)* B1(DNU_5)* B12(DNU_6)*; U?#2 G11(ZQ2_NC)* K5(CS2_a_NC)* K8(CKE2_a_NC)* N5(CS2_b_NC)* N8(CKE2_b_NC)*; U?#3 A1(DNU_1)* A2(DNU_2)* A11(DNU_3)* A12(DNU_4)* AA1(DNU_7)* AA12(DNU_8)* AB1(DNU_9)* AB2(DNU_10)* AB11(DNU_11)* AB12(DNU_12)* B1(DNU_5)* B12(DNU_6)*; U?#4 G11(ZQ2_NC)* K5(CS2_a_NC)* K8(CKE2_a_NC)* N5(CS2_b_NC)* N8(CKE2_b_NC)*

## Notes on the sheet
- LPDDR4/4X
- 0.6V
- LPDDR4
- DNP
- (near R?#11) 0R
- 1.1V
- LPDDR4x
- 0R
- Sequence:VDD1-VDD2-VDDQ
- LPDDR4    LPDDR4X
  VDD1:  1.70-1.95  1.70-1.95
  VDD2:  1.06-1.17  1.06-1.17
  VDDQ:  1.06-1.17  0.57-0.65
- 420x594
- Формат А2
- (in symbol LPDDR4_200P, part A) CH A; CH B
- (in symbol LPDDR4_200P, part B) VDD1: 1.8V; LPDDR4  LPDDR4X; VDD2: 1.1V    1.1V; VDDQ: 1.1V    0.6V